# Altium schematic sheet ISD1730.SchDoc
size A; SheetNumber: 5; SheetTotal: 10
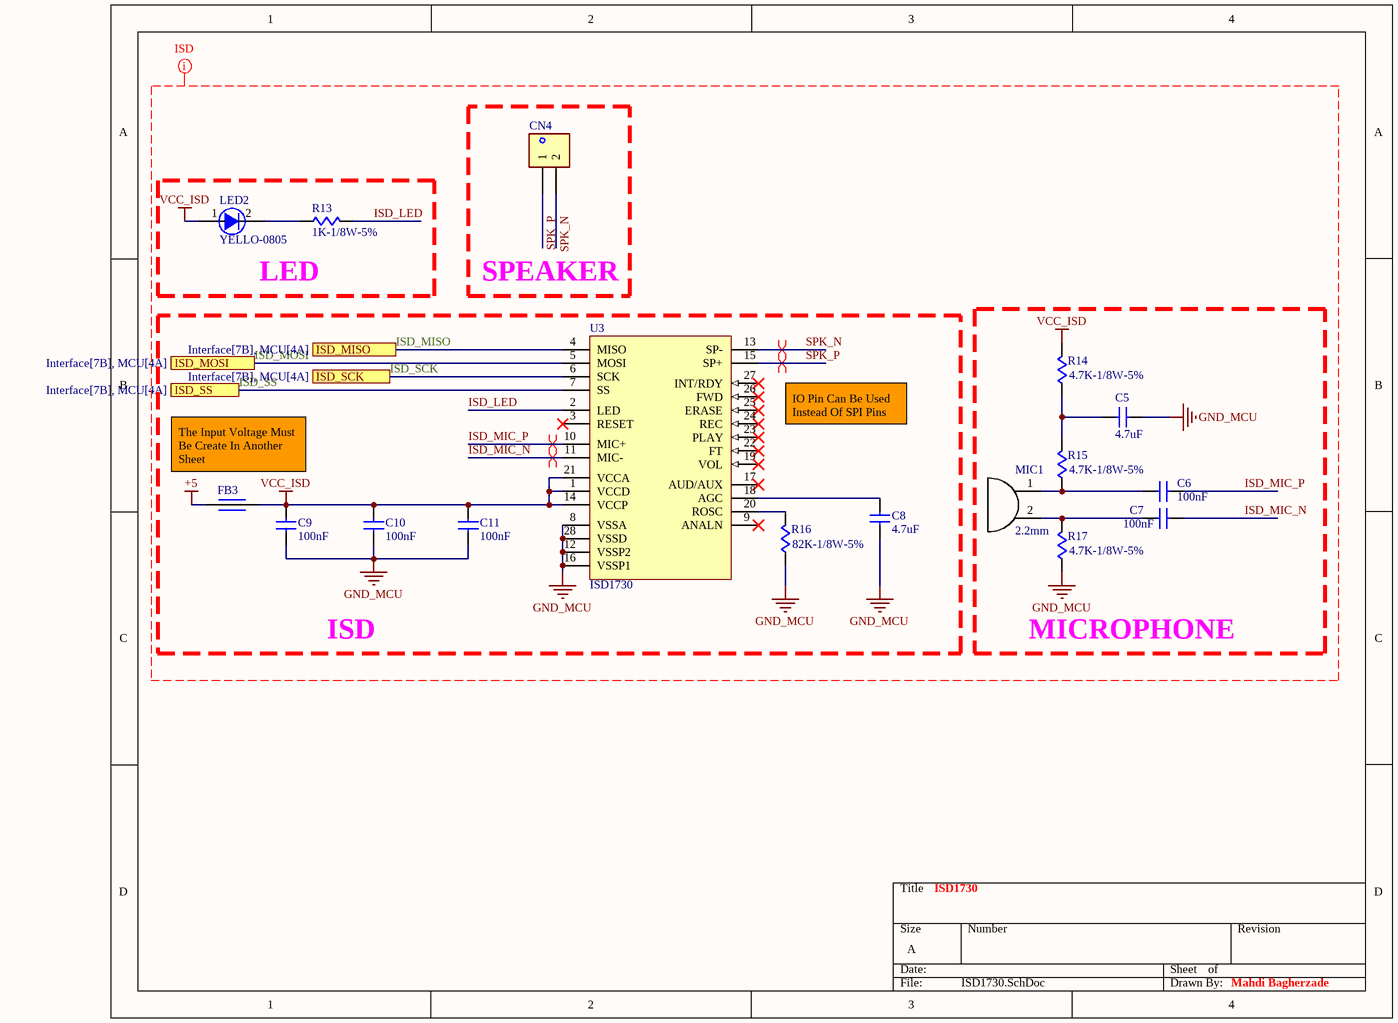
[diagram p0: ISD1730.SchDoc]

## Parts
C5  value 4.7uF  [C-0805]  (hidden comment: CAP Cer 4.7uF-50V-X7R-SMD)
C6  value 100nF  [C-0805]  (hidden comment: CAP Cer 100nF-50V-X7R-SMD)
C7  value 100nF  [C-0805]  (hidden comment: CAP Cer 100nF-50V-X7R-SMD)
C8  value 4.7uF  [C-0805]  (hidden comment: CAP Cer 4.7uF-50V-X7R-SMD)
C9  value 100nF  [C-0805]  (hidden comment: CAP Cer 100nF-50V-X7R-SMD)
C10  value 100nF  [C-0805]  (hidden comment: CAP Cer 100nF-50V-X7R-SMD)
C11  value 100nF  [C-0805]  (hidden comment: CAP Cer 100nF-50V-X7R-SMD)
CN4  XH-2  [XH-2]  (value not drawn)
FB3  FERRITE BEAD  [FB-0805]  (value not drawn)
LED2  YELLO-0805  [LED-1206-G]
MIC1  2.2mm  [MIC-2.2mm]
R13  1K-1/8W-5%  [R-0805]
R14  4.7K-1/8W-5%  [R-0805]
R15  4.7K-1/8W-5%  [R-0805]
R16  82K-1/8W-5%  [R-0805]
R17  4.7K-1/8W-5%  [R-0805]
U3  ISD1730  [DIP28-wide]

## Blocks framed on the sheet
SPEAKER: CN4
LED: LED2 R13
ISD: C8-C11 FB3 R16 U3
MICROPHONE: C5-C7 MIC1 R14 R15 R17

## Ports
ISD_MISO (see Interface[7B], MCU[4A]), ISD_MOSI (see Interface[7B], MCU[4A]), ISD_SCK (see Interface[7B], MCU[4A]), ISD_SS (see Interface[7B], MCU[4A])

## Nets
+5: FB3.1
GND_MCU: C5.2 C8.2 C9.2 C10.2 C11.2 R16.1 R17.1 U3.8(VSSA) U3.12(VSSP2) U3.16(VSSP1) U3.28(VSSD)
VCC_ISD: C9.1 C10.1 C11.1 FB3.2 LED2.1(A) R14.2 U3.1(VCCD) U3.14(VCCP) U3.21(VCCA)
ISD_LED: R13.2 U3.2(LED)
ISD_MIC_N: C7.2 U3.11(MIC-)
ISD_MIC_P: C6.2 U3.10(MIC+)
ISD_MISO: U3.4(MISO) ; port ISD_MISO
ISD_MOSI: U3.5(MOSI) ; port ISD_MOSI
ISD_SCK: U3.6(SCK) ; port ISD_SCK
ISD_SS: U3.7(SS) ; port ISD_SS
SPK_N: CN4.2 U3.13(SP-)
SPK_P: CN4.1 U3.15(SP+)
NetC5_1: C5.1 R14.1 R15.2
NetC6_1: C6.1 MIC1.1 R15.1
NetC7_1: C7.1 MIC1.2 R17.2
NetC8_1: C8.1 U3.18(AGC)
NetLED2_2: LED2.2(C) R13.1
NetR16_2: R16.2 U3.20(ROSC)

Not connected (* = marked no-connect by the designer): U3 3(RESET)* 9(ANALN)* 17(AUD/AUX)* 19(VOL)* 22(FT)* 23(PLAY)* 24(REC)* 25(ERASE)* 26(FWD)* 27(INT/RDY)*

## Layout directives
differential pair: ISD_MIC_N, ISD_MIC_P, SPK_N, SPK_P
net class ISD: +5, GND_MCU, ISD_LED, ISD_MIC_N, ISD_MIC_P, ISD_MISO, ISD_MOSI, ISD_SCK, ISD_SS, SPK_N, SPK_P, VCC_ISD

## Notes on the sheet
- IO Pin Can Be Used Instead Of SPI Pins
- The Input Voltage Must Be Create In Another Sheet
- ISD1730
- Mahdi Bagherzade

## Library data of the parts
C5-C11 = CAP-CER: CAPACITOR; Phone Number: 0915 8700 314; Voltage: 50V; Tolerance: X7R; Type: SMD; Publisher: Mahdi Bagherzadeh; ComponentLink1Description: Linkedin; ComponentLink1URL: https://ir.linkedin.com/in/mahdi-bagherzade; Published Date: 9-15-2024
CN4 = CN-2pin: CONNECTOR; Phone Number: 0915 8700 314; Publisher: Mahdi Bagherzadeh; ComponentLink1Description: Linkedin; ComponentLink1URL: https://ir.linkedin.com/in/mahdi-bagherzade; Published Date: 9-15-2024
FB3 = FERRITE BEAD: INDUCATOR; Phone Number: 0915 8700 314; Publisher: Mahdi Bagherzadeh; ComponentLink1Description: Linkedin; ComponentLink1URL: https://ir.linkedin.com/in/mahdi-bagherzade; Published Date: 9-15-2024
LED2 = LED: Phone Number: 0915 8700 314; Publisher: Mahdi Bagherzadeh; ComponentLink1Description: Linkedin; ComponentLink1URL: https://ir.linkedin.com/in/mahdi-bagherzade; Published Date: 9-15-2024
MIC1 = MIC: Phone Number: 0915 8700 314; Publisher: Mahdi Bagherzadeh; ComponentLink1Description: Linkedin; ComponentLink1URL: https://ir.linkedin.com/in/mahdi-bagherzade; Published Date: 9-15-2024
R13-R17 = RES: RESISTOR; Phone Number: 0915 8700 314; Publisher: Mahdi Bagherzadeh; ComponentLink1Description: Linkedin; ComponentLink1URL: https://ir.linkedin.com/in/mahdi-bagherzade; Published Date: 9-15-2024
U3 = ISD1730: IC; Phone Number: 0915 8700 314; Publisher: Mahdi Bagherzadeh; ComponentLink1Description: Linkedin; ComponentLink1URL: https://ir.linkedin.com/in/mahdi-bagherzade; Published Date: 9-15-2024